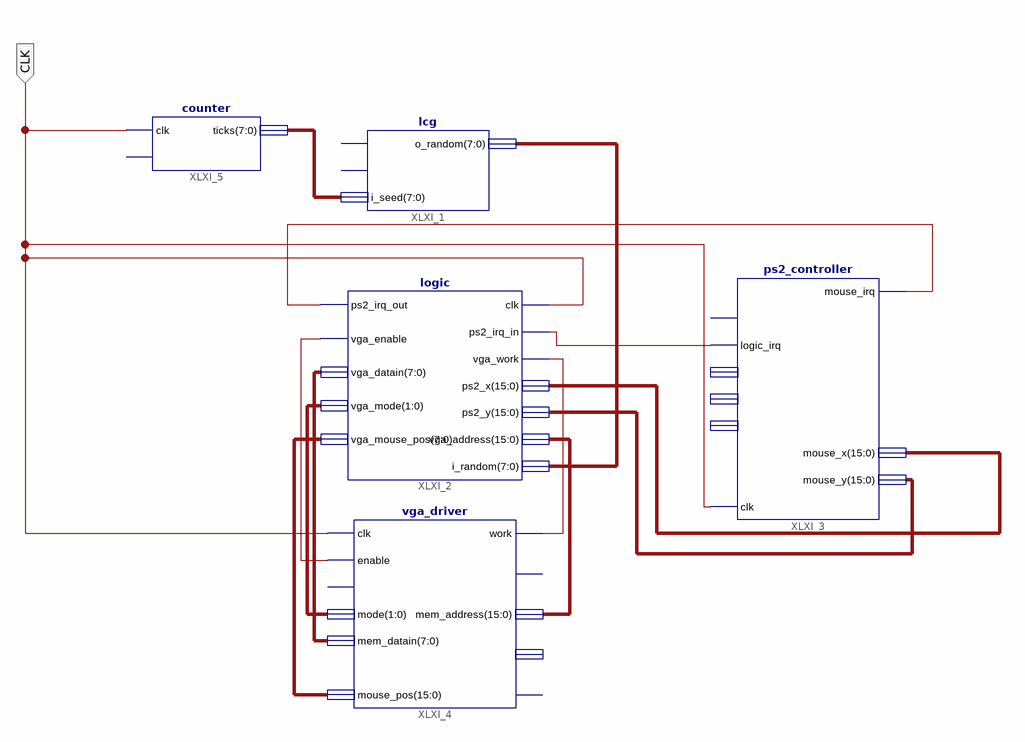
[diagram p0: schematic sheet 1]
// Xilinx ISE schematic memgame.sch (spartan3e) as structural Verilog: 5 symbols, 1 ports
module memgame (
  input  CLK
);

  wire XLXN_12, XLXN_18, XLXN_21, XLXN_23;
  wire [1:0] XLXN_17;
  wire [7:0] XLXN_16, XLXN_20, XLXN_22, XLXN_24;
  wire [15:0] XLXN_13, XLXN_14, XLXN_19;

  lcg XLXI_1 (.i_seed(XLXN_22), .o_random(XLXN_20));  // open: i_generate, i_reset
  \logic  XLXI_2 (
    .clk(CLK), .ps2_irq_in(XLXN_21), .vga_work(XLXN_12), .i_random(XLXN_20), .ps2_x(XLXN_13),
    .ps2_y(XLXN_14), .vga_address(XLXN_19), .ps2_irq_out(XLXN_23), .vga_enable(XLXN_18),
    .vga_datain(XLXN_16), .vga_mode(XLXN_17), .vga_mouse_pos(XLXN_24));
  ps2_controller XLXI_3 (
    .clk(CLK), .logic_irq(XLXN_21), .mouse_irq(XLXN_23), .mouse_x(XLXN_13), .mouse_y(XLXN_14));  // open: dataready, B1_status, B2_X, B3_Y
  vga_driver XLXI_4 (
    .clk(CLK), .enable(XLXN_18), .mode(XLXN_17), .mem_datain(XLXN_16), .work(XLXN_12), .mem_address(XLXN_19),
    .mouse_pos(XLXN_24));  // open: vga_busy, vga_we, vga_data, vga_reset
  counter XLXI_5 (.clk(CLK), .ticks(XLXN_22));  // open: reset
endmodule
